# Altium schematic sheet [04] - REVISION HISTORY.SchDoc
size Letter; Author: Paola Andrea Ayala Pineda; Organization: Altium Limited; Address1: L3, 12a Rodborough Rd; Address2: Frenchs Forest; Address3: NSW; Address4: Australia 2086; Revision: 1.0; SheetNumber: 1; SheetTotal: 5; Carnet: 19091
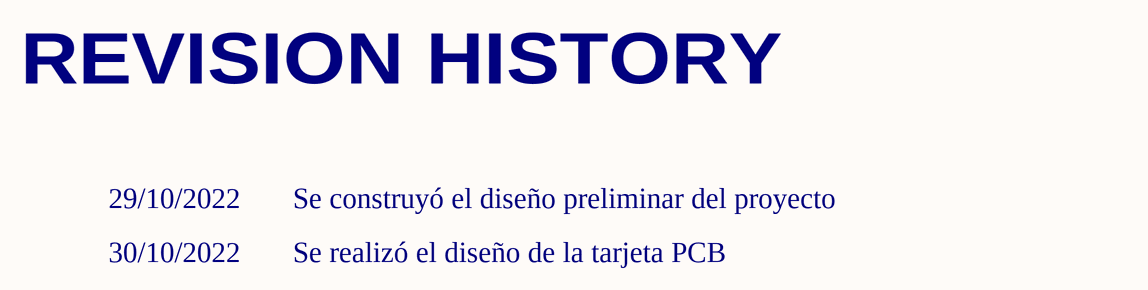
[diagram p0: [04] - REVISION HISTORY.SchDoc]

## Notes on the sheet
- REVISION HISTORY
- 29/10/2022       Se construyó el diseño preliminar del proyecto
- 30/10/2022       Se realizó el diseño de la tarjeta PCB
- Proyecto:
- Documento:
- Autor:
- Carnet:
- Fecha:
- Revision:
- Tamaño:
- Carta
- Hoja:
- de